# EAGLE design IRtr (EAGLE 8.1.1)
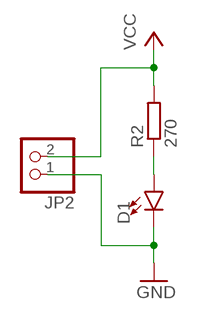
[diagram p0: schematic, sheet 1]

## Parts
D1  LED-IRSIDE_EMITTER  [LTE-302]
JP2  PINHD-1X2  [1X02]
R2  270  R-EU_R0805  [R0805]

## Nets
GND: D1.C JP2.1
N$3: D1.A R2.1
VCC: JP2.2 R2.2

## Library data of the parts
D1 = SparkFun-LED:LED-IR: Infrared LED (IR) Wavelength: 940nm Packages: TSAL6100 LTE302 - Side firing. Check SparkFun-Sensors.lbr for the receiver SparkFun Products: ZX Distance and Gesture Sensor <[https://www.sparkfun.com/products/12780]> Infrared Emitters and Detectors <https://www.sparkfun.com/products/241>; PROD_ID: DIO-10904; SF_ID: SEN-00241
JP2 = pinhead:PINHD-1X2: PIN HEADER
R2 = resistor:R-EU_: RESISTOR, European symbol

## Board
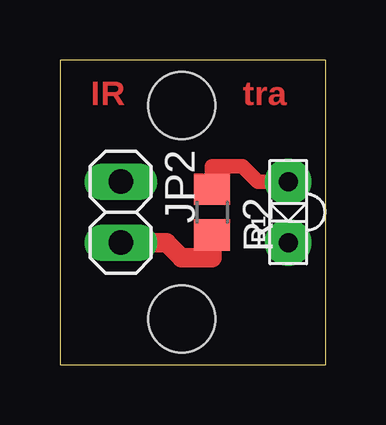
[diagram p1: board, top side]
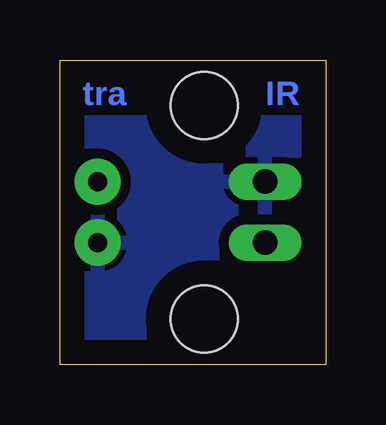
[diagram p2: board, bottom side, seen from below]

Size 11.1 x 12.69 mm. Coordinates in mm from the lower left corner, seen from the top.
Outline: 0,0 11.1,0 11.1,12.69 0,12.69 0,0
Copper layers (1*16): Top 0.035mm / dielectric 1.5mm / Bottom 0.035mm
Design rules "default": minimum track width 10mil, minimum drill 24mil, track to track 8mil, track to pad 8mil, pad to pad 8mil, via to via 8mil, smd to smd 8mil, copper to edge 40mil, drill to drill 8mil, minimum pad ring 10mil, minimum via ring 8mil, stop-mask expansion 4mil, vias tented up to drill 0mil, thermal gap 10mil
Holes 2.8 mm at 5.08,1.91 5.08,10.79

### Footprints (pad centres in the part's own frame; a part is rotated, then mirrored left to right if it is on the bottom)
LTE-302 = drill 0.8 pad 1.93: A 1.27,0; C -1.27,0
1X02 = drill 1.016 long: 1 -1.27,0; 2 1.27,0
R0805 = smd 1.3 x 1.5: 1 -0.95,0; 2 0.95,0

### Placement (x,y rotation side)
D1  9.53,6.35 90 top
JP2  2.54,6.35 270 top
R2  6.35,6.35 270 top

### Tracks (layer width: path | path; a pad name or v marks a point on that pad's centre or on a via)
GND
  pour Bottom (isolate 0.406): 0,12.7 11.43,12.7 11.43,0 0,0
N$3
  Top 0.61: D1.A 8.26,7.62 7.62,8.26 6.35,8.26 R2.1
VCC
  Top 0.813: JP2.2 4.45,5.08 5.08,4.45 6.35,4.45 R2.2

### Text on the board
Top: IR | tra
Bottom: IR | tra